# EAGLE design MCB-Laird-BL652-v2.0.0 (EAGLE 7.7.0)

## Sheet 1 of 2
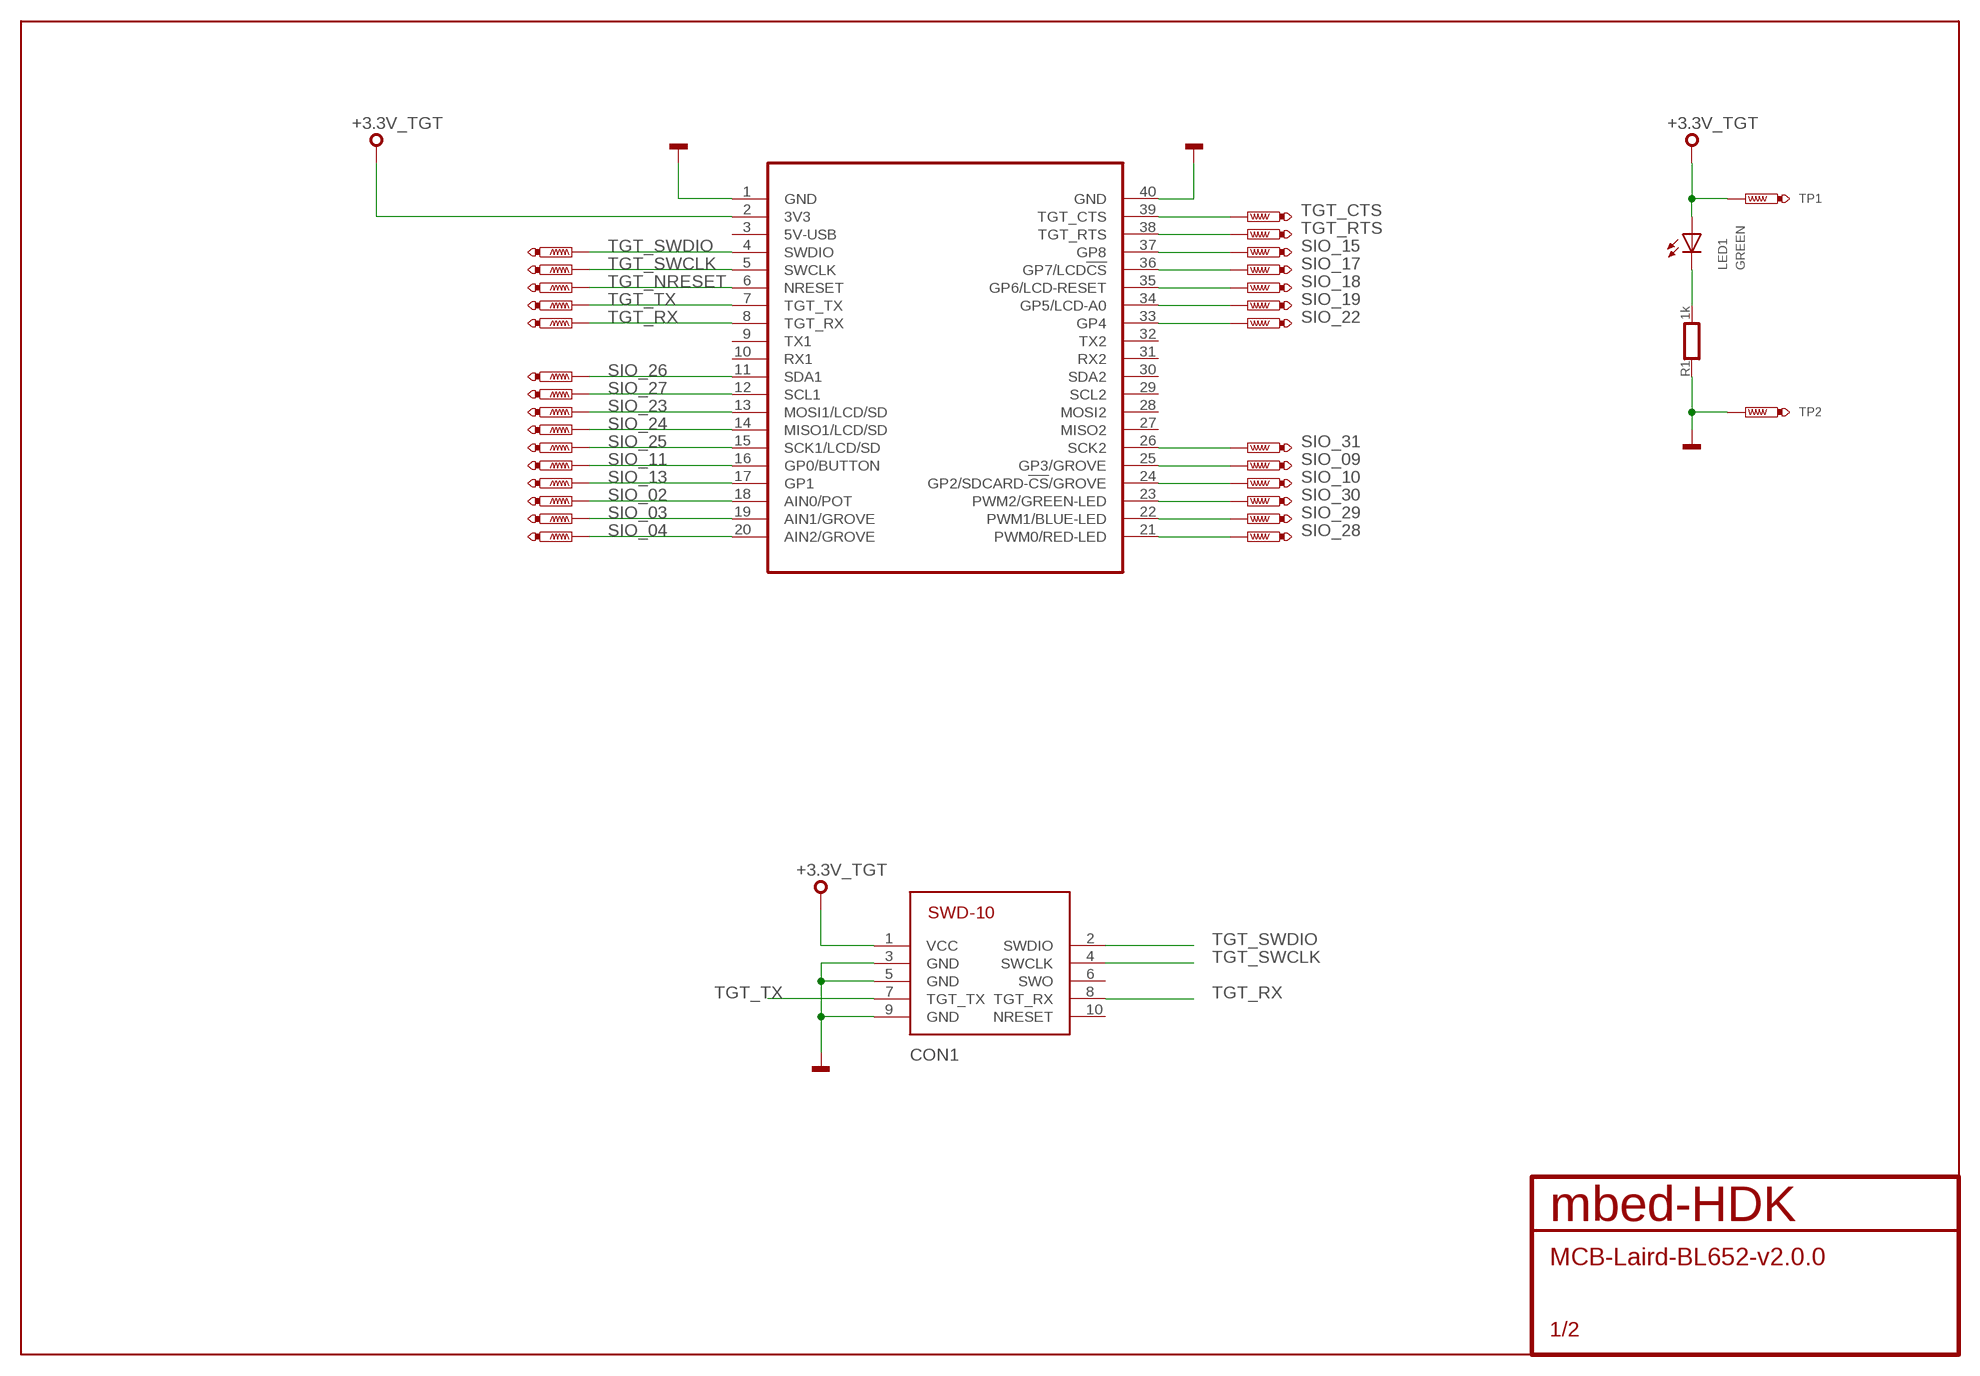
[diagram p0: schematic, sheet 1]

### Parts
CON1  SWD-10/TC2050_SMD  [FTSH-105-02]
LED1  GREEN  SMD_LED0603  [CHIPLED_0603]
MOD1  MODULE_DAUGHTER  [MODULE_DAUGHTER]
R1  1k  RESISTOR0603  [0603]
TP1  TEST-POINT-50R-PTH  [TP50-PTH]
TP2  TEST-POINT-50R-PTH  [TP50-PTH]
TP3  PTR1TP07R  [TP07R]
TP4  PTR1TP07R  [TP07R]
TP5  PTR1TP07R  [TP07R]
TP6  PTR1TP07R  [TP07R]
TP7  PTR1TP07R  [TP07R]
TP8  PTR1TP07R  [TP07R]
TP9  PTR1TP07R  [TP07R]
TP10  PTR1TP07R  [TP07R]
TP11  PTR1TP07R  [TP07R]
TP12  PTR1TP07R  [TP07R]
TP13  PTR1TP07R  [TP07R]
TP14  PTR1TP07R  [TP07R]
TP15  PTR1TP07R  [TP07R]
TP16  PTR1TP07R  [TP07R]
TP17  PTR1TP07R  [TP07R]
TP18  PTR1TP07R  [TP07R]
TP19  PTR1TP07R  [TP07R]
TP20  PTR1TP07R  [TP07R]
TP21  PTR1TP07R  [TP07R]
TP22  PTR1TP07R  [TP07R]
TP23  PTR1TP07R  [TP07R]
TP24  PTR1TP07R  [TP07R]
TP25  PTR1TP07R  [TP07R]
TP26  PTR1TP07R  [TP07R]
TP27  PTR1TP07R  [TP07R]
TP28  PTR1TP07R  [TP07R]
TP29  PTR1TP07R  [TP07R]
TP30  PTR1TP07R  [TP07R]

### Nets
+3.3V_TGT: CON1.1(VCC) LED1.A MOD1.2(3V3) TP1.TP ; also sheet 2
GND: CON1.3(GND) CON1.5(GND) CON1.9(GND) MOD1.1(GND) MOD1.40(GND) R1.1 TP2.TP ; also sheet 2
PA_1: LED1.C R1.2
SIO_02: MOD1.18(AIN0/POT) TP10.TP ; also sheet 2
SIO_03: MOD1.19(AIN1/GROVE) TP11.TP ; also sheet 2
SIO_04: MOD1.20(AIN2/GROVE) TP12.TP ; also sheet 2
SIO_09: MOD1.25(GP3/GROVE) TP17.TP ; also sheet 2
SIO_10: MOD1.24(GP2/SDCARD-!CS!/GROVE) TP16.TP ; also sheet 2
SIO_11: MOD1.16(GP0/BUTTON) TP8.TP ; also sheet 2
SIO_13: MOD1.17(GP1) TP9.TP ; also sheet 2
SIO_15: MOD1.37(GP8) TP22.TP ; also sheet 2
SIO_17: MOD1.36(GP7/LCD!CS) TP21.TP ; also sheet 2
SIO_18: MOD1.35(GP6/LCD-RESET) TP20.TP ; also sheet 2
SIO_19: MOD1.34(GP5/LCD-A0) TP19.TP ; also sheet 2
SIO_22: MOD1.33(GP4) TP18.TP ; also sheet 2
SIO_23: MOD1.13(MOSI1/LCD/SD) TP5.TP ; also sheet 2
SIO_24: MOD1.14(MISO1/LCD/SD) TP6.TP ; also sheet 2
SIO_25: MOD1.15(SCK1/LCD/SD) TP7.TP ; also sheet 2
SIO_26: MOD1.11(SDA1) TP3.TP ; also sheet 2
SIO_27: MOD1.12(SCL1) TP4.TP ; also sheet 2
SIO_28: MOD1.21(PWM0/RED-LED) TP13.TP ; also sheet 2
SIO_29: MOD1.22(PWM1/BLUE-LED) TP14.TP ; also sheet 2
SIO_30: MOD1.23(PWM2/GREEN-LED) TP15.TP ; also sheet 2
SIO_31: MOD1.26(SCK2) TP25.TP ; also sheet 2
TGT_CTS: MOD1.39(TGT_CTS) TP24.TP ; also sheet 2
TGT_NRESET: MOD1.6(NRESET) TP28.TP ; also sheet 2
TGT_RTS: MOD1.38(TGT_RTS) TP23.TP ; also sheet 2
TGT_RX: CON1.8(TGT_RX) MOD1.8(TGT_RX) TP30.TP ; also sheet 2
TGT_SWCLK: CON1.4(SWCLK) MOD1.5(SWCLK) TP27.TP ; also sheet 2
TGT_SWDIO: CON1.2(SWDIO) MOD1.4(SWDIO) TP26.TP ; also sheet 2
TGT_TX: CON1.7(TGT_TX) MOD1.7(TGT_TX) TP29.TP ; also sheet 2
Unconnected: CON1.6(SWO) CON1.10(NRESET) MOD1.3(5V-USB) MOD1.9(TX1) MOD1.10(RX1) MOD1.27(MISO2) MOD1.28(MOSI2) MOD1.29(SCL2) MOD1.30(SDA2) MOD1.31(RX2) MOD1.32(TX2)

## Sheet 2 of 2
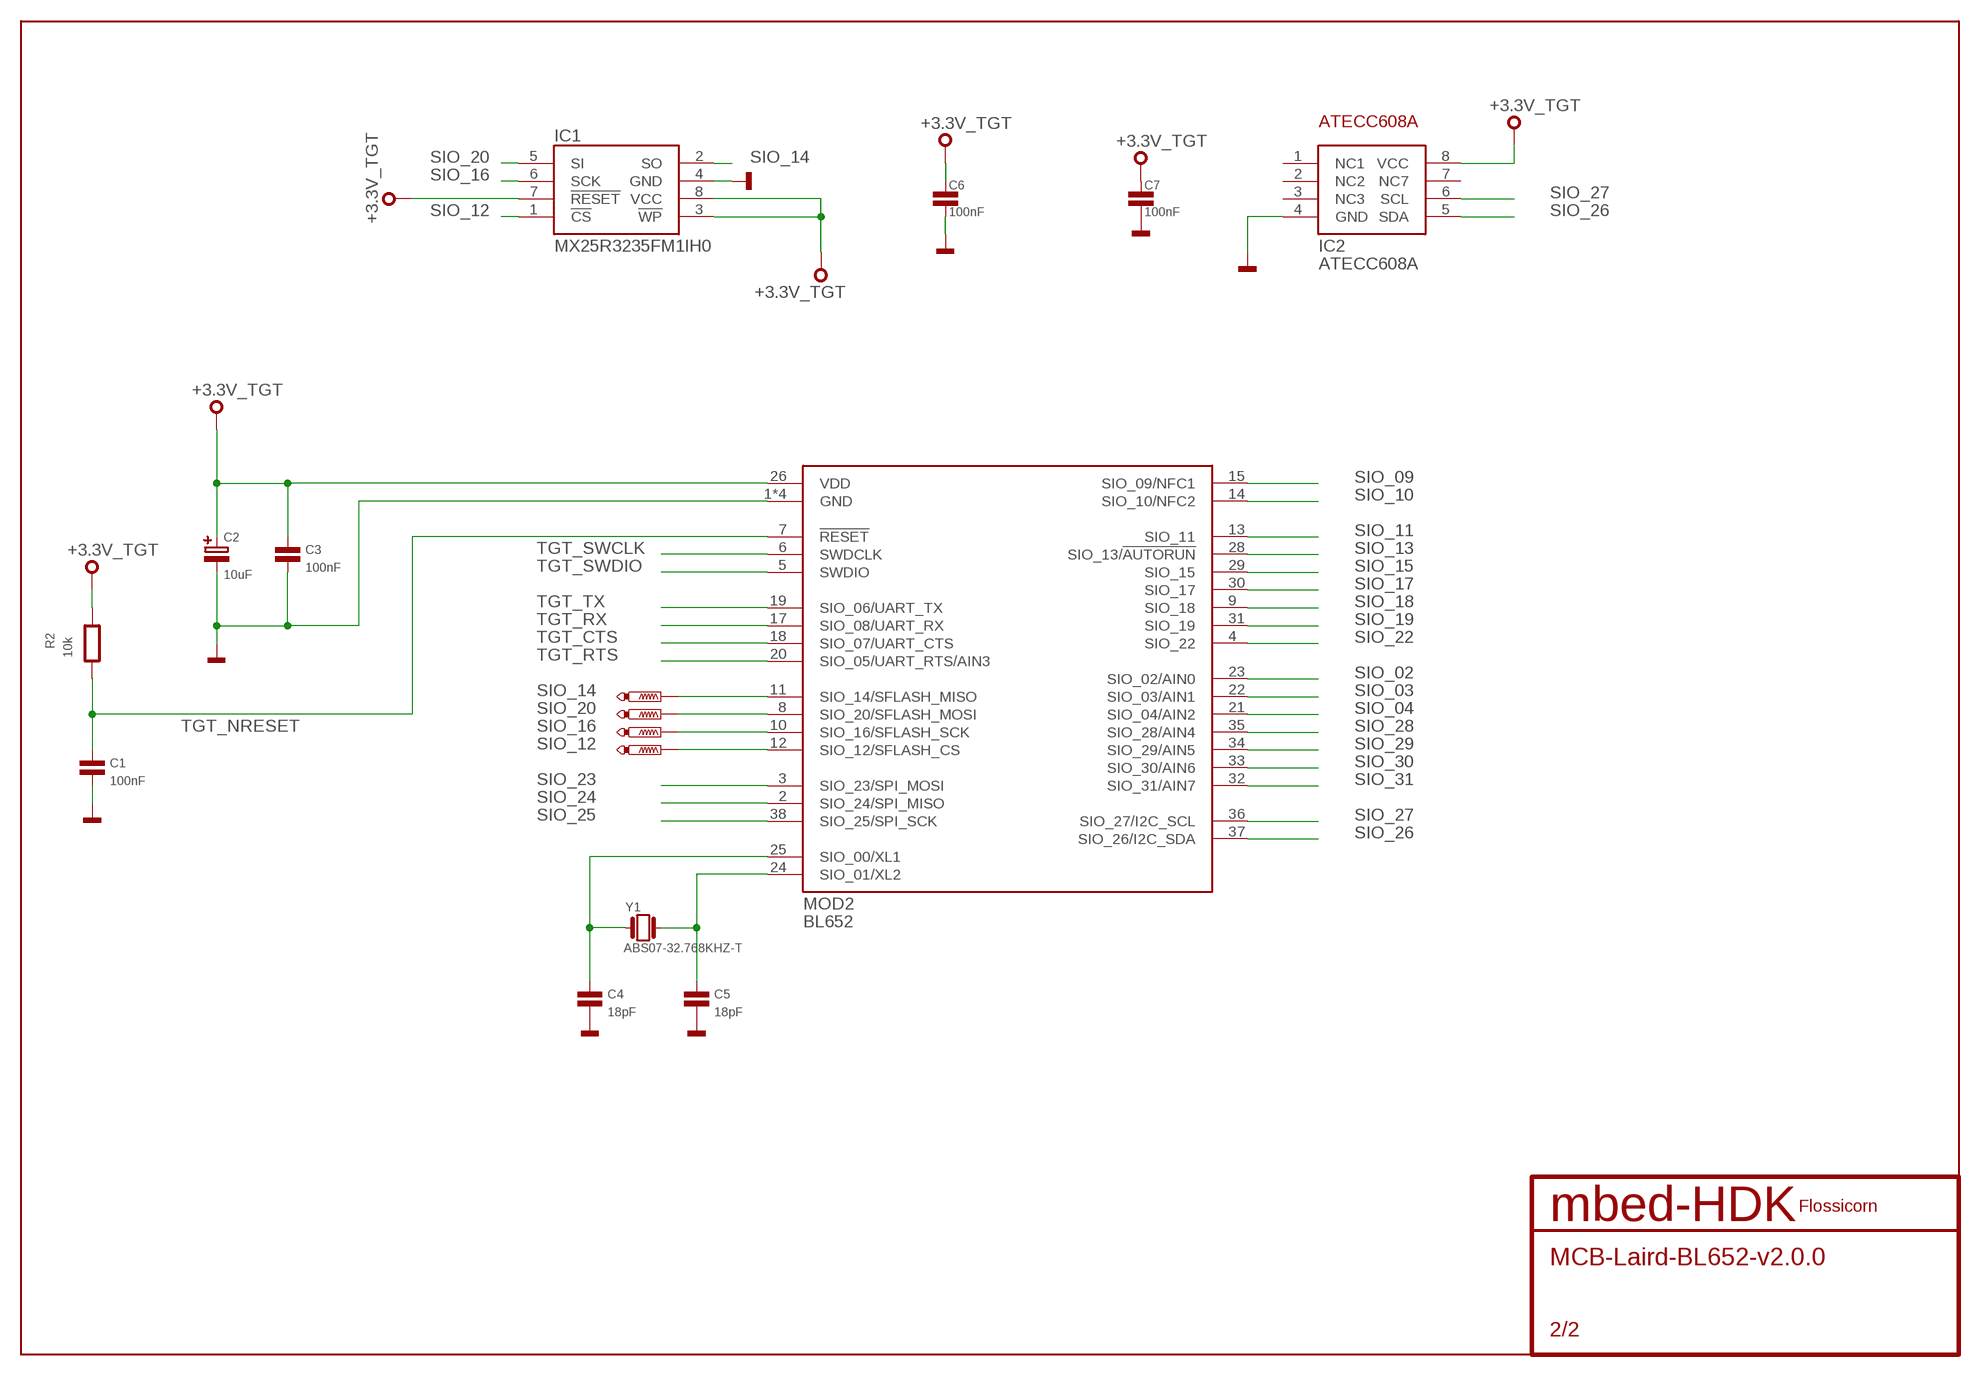
[diagram p1: schematic, sheet 2]

### Parts
C1  100nF  C0603  [0603]
C2  10uF  CAPACITOR-POLARISEDB  [SMC_B]
C3  100nF  C0603  [0603]
C4  18pF  C0603  [0603]
C5  18pF  C0603  [0603]
C6  100nF  CAPACITOR0603  [0603]
C7  100nF  CAPACITOR0603  [0603]
IC1  MX25R3235FM1IH0  [SO8]
IC2  ATECC608A  [SO8]
MOD2  BL652  [BL652]
R2  10k  RESISTOR0603  [0603]
SS1  FLOSSICORN0.25  [FLOSSICORN-0.25]
TP31  PTR1TP07R  [TP07R]
TP32  PTR1TP07R  [TP07R]
TP33  PTR1TP07R  [TP07R]
TP34  PTR1TP07R  [TP07R]
Y1  ABS07-32.768KHZ-T  [FC135]

### Nets
+3.3V_TGT: C2.+ C3.1 C6.1 C7.1 IC1.3(!WP) IC1.7(!RESET) IC1.8(VCC) IC2.8(VCC) MOD2.26(VDD) R2.2 ; also sheet 1
GND: C1.2 C2.- C3.2 C4.2 C5.2 C6.2 C7.2 IC1.4(GND) IC2.4(GND) MOD2.1(GND) MOD2.16(GND) MOD2.27(GND) MOD2.39(GND) ; also sheet 1
N$2: C5.1 MOD2.24(SIO_01/XL2) Y1.X2
N$3: C4.1 MOD2.25(SIO_00/XL1) Y1.X1
SIO_02: MOD2.23(SIO_02/AIN0) ; also sheet 1
SIO_03: MOD2.22(SIO_03/AIN1) ; also sheet 1
SIO_04: MOD2.21(SIO_04/AIN2) ; also sheet 1
SIO_09: MOD2.15(SIO_09/NFC1) ; also sheet 1
SIO_10: MOD2.14(SIO_10/NFC2) ; also sheet 1
SIO_11: MOD2.13(SIO_11) ; also sheet 1
SIO_12: IC1.1(!CS) MOD2.12(SIO_12/SFLASH_CS) TP34.TP
SIO_13: MOD2.28(SIO_13/!AUTORUN) ; also sheet 1
SIO_14: IC1.2(SO) MOD2.11(SIO_14/SFLASH_MISO) TP31.TP
SIO_15: MOD2.29(SIO_15) ; also sheet 1
SIO_16: IC1.6(SCK) MOD2.10(SIO_16/SFLASH_SCK) TP33.TP
SIO_17: MOD2.30(SIO_17) ; also sheet 1
SIO_18: MOD2.9(SIO_18) ; also sheet 1
SIO_19: MOD2.31(SIO_19) ; also sheet 1
SIO_20: IC1.5(SI) MOD2.8(SIO_20/SFLASH_MOSI) TP32.TP
SIO_22: MOD2.4(SIO_22) ; also sheet 1
SIO_23: MOD2.3(SIO_23/SPI_MOSI) ; also sheet 1
SIO_24: MOD2.2(SIO_24/SPI_MISO) ; also sheet 1
SIO_25: MOD2.38(SIO_25/SPI_SCK) ; also sheet 1
SIO_26: IC2.5(SDA) MOD2.37(SIO_26/I2C_SDA) ; also sheet 1
SIO_27: IC2.6(SCL) MOD2.36(SIO_27/I2C_SCL) ; also sheet 1
SIO_28: MOD2.35(SIO_28/AIN4) ; also sheet 1
SIO_29: MOD2.34(SIO_29/AIN5) ; also sheet 1
SIO_30: MOD2.33(SIO_30/AIN6) ; also sheet 1
SIO_31: MOD2.32(SIO_31/AIN7) ; also sheet 1
TGT_CTS: MOD2.18(SIO_07/UART_CTS) ; also sheet 1
TGT_NRESET: C1.1 MOD2.7(!RESET) R2.1 ; also sheet 1
TGT_RTS: MOD2.20(SIO_05/UART_RTS/AIN3) ; also sheet 1
TGT_RX: MOD2.17(SIO_08/UART_RX) ; also sheet 1
TGT_SWCLK: MOD2.6(SWDCLK) ; also sheet 1
TGT_SWDIO: MOD2.5(SWDIO) ; also sheet 1
TGT_TX: MOD2.19(SIO_06/UART_TX) ; also sheet 1
Unconnected: IC2.1(NC1) IC2.2(NC2) IC2.3(NC3) IC2.7(NC7)

## Library data of the parts
C1 C3-C5 = mbed-HDK-RLC:C: Capacitor
C2 = mbed-HDK-RLC:CAPACITOR-POLARISED: Polarised capacitor; MF: Kemet; MFN: T491B106K020AT; OC-DIGIKEY: 399-8298-1-ND; OC-MOUSER: 80-T491B106K020; OC-NEWARK: 57K1740
C6 C7 = mbed-HDK-RLC:CAPACITOR: Capacitor
CON1 = mbed-HDK-Connector:SWD-10/TC2050: 1mm pitch 10-Pin Cortex Programming Header with optional TC2050 footprint solderless interchangeable
IC1 = mbed-HDK-IC:MX25R3235FM1IH0: Serial Flash 32 Mb 80 Mhz; MF: Macronix; MFN: MX25R3235FM1IH0; OC-DIGIKEY: 1092-1175-ND
IC2 = mbed-HDK-MF-ATMEL:ATECC608A: I2C Secure element and crytpo accelerator; MF: Atmel; MFN: ATECC608A; OC-DIGIKEY: ATECC608A-SSHCZ-TCT-ND; OC-MOUSER: 556-ATECC608ASSHDAB
LED1 = mbed-HDK-Optical:SMD_LED: LED SMD, Colour Red; MF: Wurth Electronics Inc; MFN: 150060RS75000; OC-DIGIKEY: 732-4978-1-ND; OC-MOUSER: 710-150060RS75000; OC-NEWARK: 2322071
MOD1 = mbed-HDK-misc-Board:MODULE_DAUGHTER
MOD2 = mbed-HDK-MF-LAIRD:BL652: nRF52 Based BLE module; MF: Laird; MFN: BL652; OC-MOUSER: 239-BL652-SA-01; OC-NEWARK: 2664536
R1 R2 = mbed-HDK-RLC:RESISTOR: Resistor
SS1 = blackbriar:FLOSSICORN
TP1 TP2 = mbed-HDK:TEST-POINT
TP3-TP34 = blackbriar:PTR1: TEST PIN
Y1 = mbed-HDK-Oscillator:ABS07-32.768KHZ-T: Crystal, Abracon 32.768kHz ±20ppm 12.5pF; MF: Abracon; MFN: ABS07-32.768KHZ-T; OC-DIGIKEY: 535-9542-1-ND; OC-MOUSER: 535-9542-1-ND; OC-NEWARK: 2101347

## Board
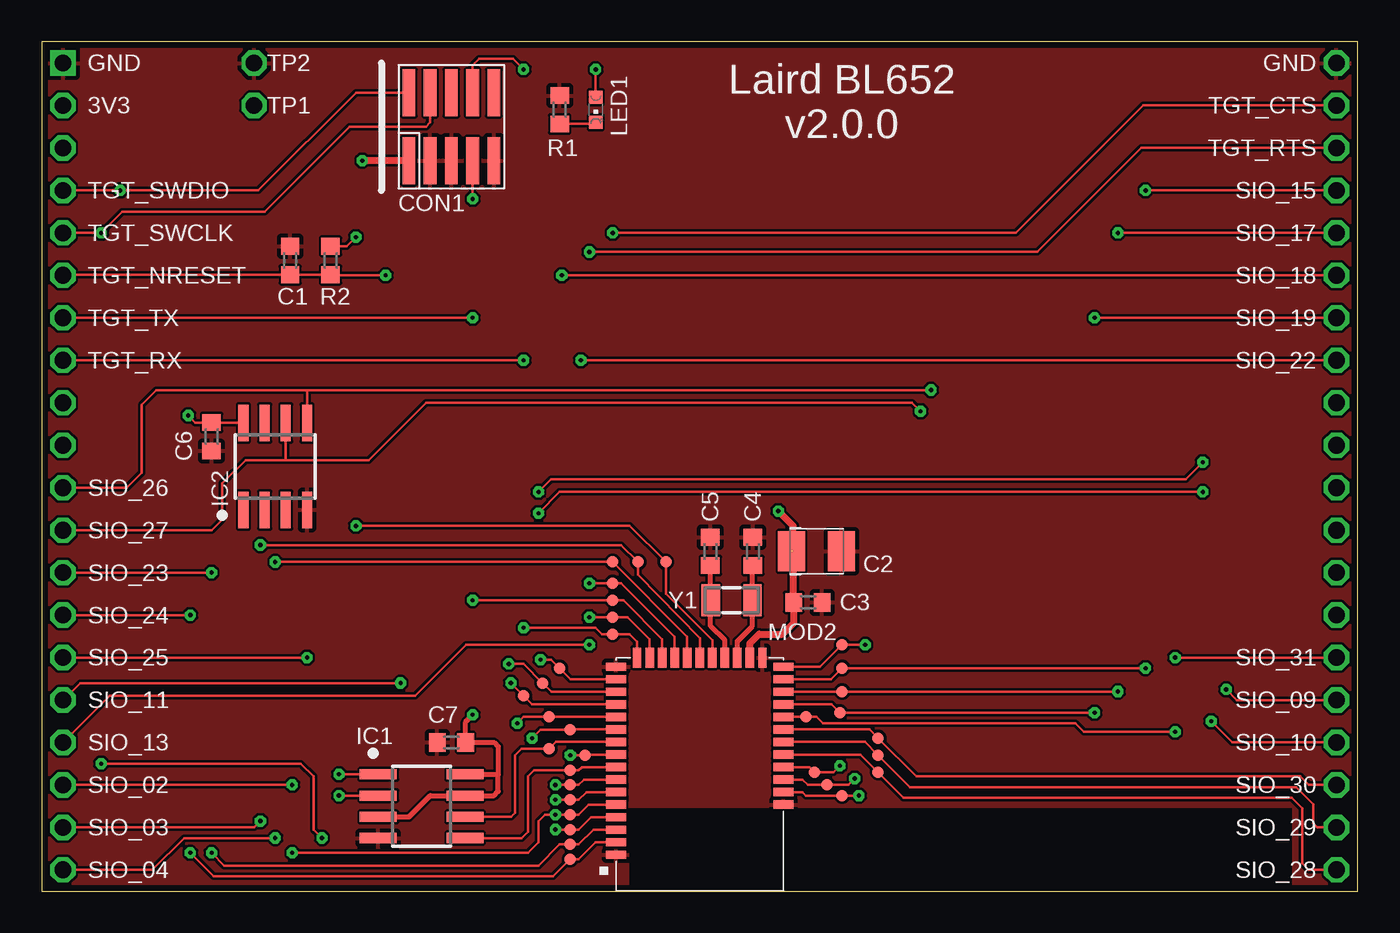
[diagram p2: board, top side]
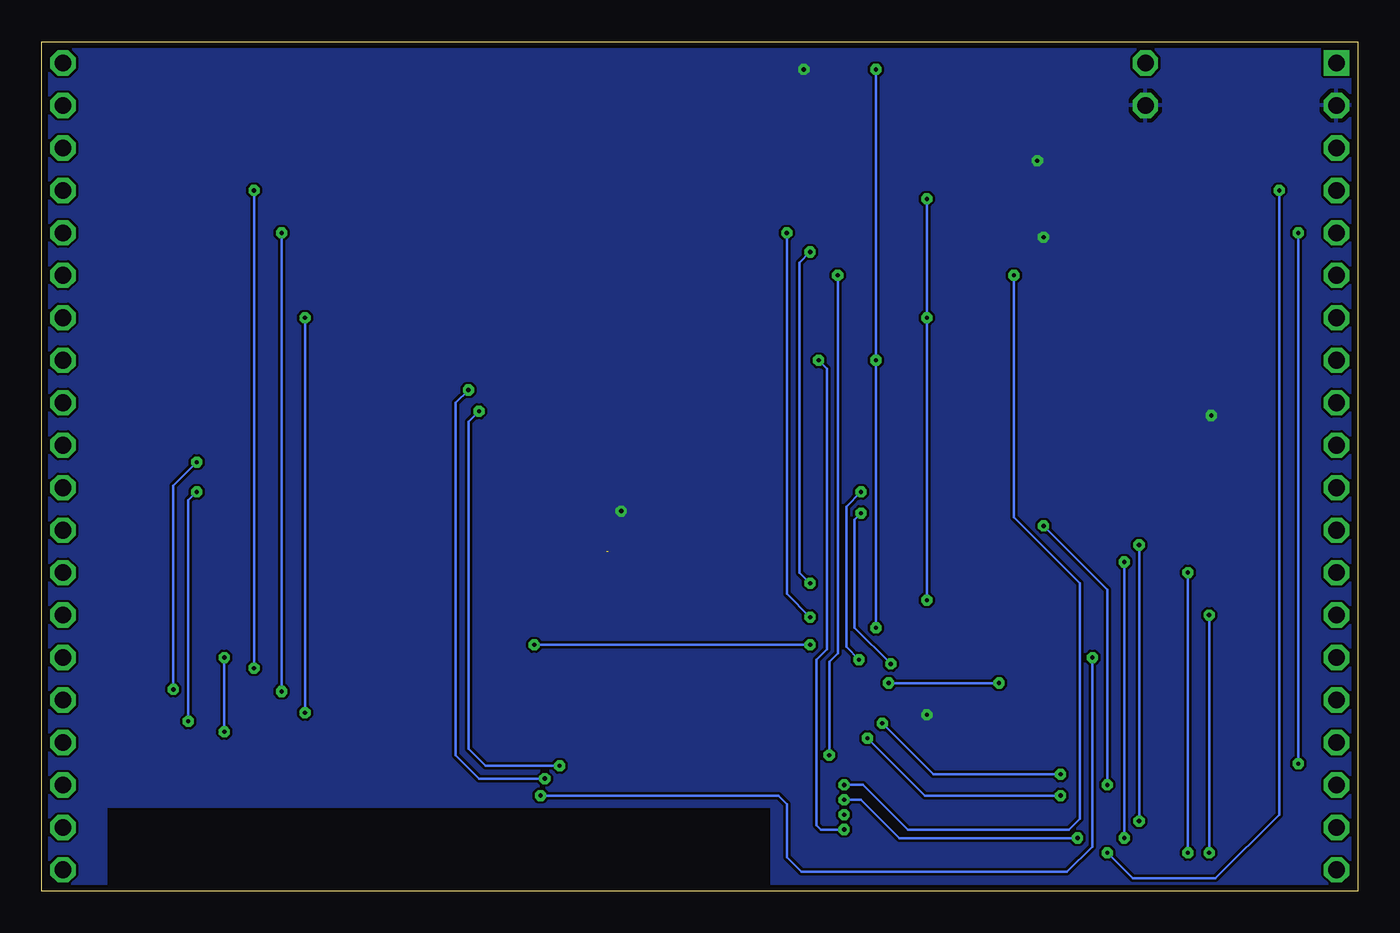
[diagram p3: board, bottom side, seen from below]

Size 78.74 x 50.8 mm. Coordinates in mm from the lower left corner, seen from the top.
Copper layers ((1*16)): Top 0.035mm / dielectric 0.8mm / Bottom 0.035mm
Design rules "mbed-HDK-6-6-2-layer *": minimum track width 6mil, minimum drill 9mil, track to track 6mil, track to pad 6mil, pad to pad 6mil, via to via 6mil, smd to smd 6mil, copper to edge 15mil, drill to drill 8mil, minimum pad ring 10mil, minimum via ring 8mil, stop-mask expansion 4mil, vias tented up to drill 0mil, thermal gap 10mil
tRestrict: area 35.2,0 to 74.8,5
bRestrict: area 35.2,0 to 74.8,5

### Footprints (pad centres in the part's own frame; a part is rotated, then mirrored left to right if it is on the bottom)
0603 = smd 1 x 1.1: 1 -0.85,0; 2 0.85,0
SMC_B = smd 1.6 x 2.4: + -1.5,0; - 1.5,0
FTSH-105-02 = smd 0.762 x 2.794: 1 0.381,-2.032; 2 0.381,2.032; 3 1.651,-2.032; 4 1.651,2.032; 5 2.921,-2.032; 6 2.921,2.032; 7 4.191,-2.032; 8 4.191,2.032; 9 5.461,-2.032; 10 5.461,2.032
SO8 = smd 0.6 x 2.2: 1 -1.905,-2.6; 2 -0.635,-2.6; 3 0.635,-2.6; 4 1.905,-2.6; 5 1.905,2.6; 6 0.635,2.6; 7 -0.635,2.6; 8 -1.905,2.6
CHIPLED_0603 = smd 0.8 x 0.8: A 0,-0.75; C 0,0.75
MODULE_DAUGHTER = drill 1 square: 1 0,0 | drill 1 octagon: 2 0,-2.54; 3 0,-5.08; 4 0,-7.62; 5 0,-10.16; 6 0,-12.7; 7 0,-15.24; 8 0,-17.78; 9 0,-20.32; 10 0,-22.86; 11 0,-25.4; 12 0,-27.94; 13 0,-30.48; 14 0,-33.02; 15 0,-35.56; 16 0,-38.1; 17 0,-40.64; 18 0,-43.18; 19 0,-45.72; 20 0,-48.26; 21 76.2,-48.26; 22 76.2,-45.72; 23 76.2,-43.18; 24 76.2,-40.64; 25 76.2,-38.1; 26 76.2,-35.56; 27 76.2,-33.02; 28 76.2,-30.48; 29 76.2,-27.94; 30 76.2,-25.4; 31 76.2,-22.86; 32 76.2,-20.32; 33 76.2,-17.78; 34 76.2,-15.24; 35 76.2,-12.7; 36 76.2,-10.16; 37 76.2,-7.62; 38 76.2,-5.08; 39 76.2,-2.54; 40 76.2,0
BL652 = smd 1.2 x 0.5: 1 5,11.8; 2 5,11.05; 3 5,10.3; 4 5,9.55; 5 5,8.8; 6 5,8.05; 7 5,7.3; 8 5,6.55; 9 5,5.8; 10 5,5.05; 11 5,4.3; 12 5,3.55; 13 5,2.8; 14 5,2.05; 15 5,1.3; 16 5,0.55; 28 -5,0.55; 29 -5,1.3; 30 -5,2.05; 31 -5,2.8; 32 -5,3.55; 33 -5,4.3; 34 -5,5.05; 35 -5,5.8; 36 -5,6.55; 37 -5,7.3; 38 -5,8.05; 39 -5,8.8 | smd 0.5 x 1.2: 17 3.75,0; 18 3,0; 19 2.25,0; 20 1.5,0; 21 0.75,0; 22 0,0; 23 -0.75,0; 24 -1.5,0; 25 -2.25,0; 26 -3,0; 27 -3.75,0
TP50-PTH = drill 1 octagon: TP 0,0
TP07R = smd 0.7 x 0.7: TP 0,0
FC135 = smd 1.1 x 1.9: X1 -1.25,0; X2 1.25,0

### Placement (x,y rotation side)
C1  14.86,37.72 90 top
C2  46.36,20.32 0 top
C3  45.85,17.27 0 top
C4  42.55,20.32 90 top
C5  40.01,20.32 90 top
C6  10.16,27.18 270 top
C7  24.51,8.89 180 top
CON1  21.59,45.72 0 top
IC1  22.73,5.08 270 top
IC2  13.97,25.4 0 top
LED1  33.15,46.74 180 top
MOD1  1.27,49.53 0 top
MOD2  39.37,13.97 180 top
R1  30.99,46.74 270 top
R2  17.27,37.72 90 top
SS1  21.59,35.94 0 top
TP1  12.7,46.99 0 top
TP2  12.7,49.53 0 top
TP3  46.99,6.35 0 top
TP4  46.23,7.11 0 top
TP5  31.62,2.79 0 top
TP6  31.62,1.91 0 top
TP7  47.88,5.72 90 top
TP8  28.83,11.68 90 top
TP9  47.88,14.73 90 top
TP10  37.34,19.69 180 top
TP11  35.69,19.69 180 top
TP12  34.16,19.69 90 top
TP13  50.04,7.11 270 top
TP14  50.04,8.13 270 top
TP15  50.04,9.14 270 top
TP16  29.97,12.45 0 top
TP17  30.99,13.34 270 top
TP18  31.62,3.68 180 top
TP19  47.75,10.67 270 top
TP20  32.51,8.13 270 top
TP21  47.88,11.94 270 top
TP22  47.88,13.34 270 top
TP23  34.16,18.42 270 top
TP24  34.16,16.38 270 top
TP25  45.72,10.41 0 top
TP26  31.62,4.57 0 top
TP27  31.62,5.46 0 top
TP28  31.62,6.35 0 top
TP29  34.16,17.4 0 top
TP30  34.16,15.37 0 top
TP31  31.62,9.65 0 top
TP32  31.62,7.24 0 top
TP33  30.35,8.51 0 top
TP34  30.35,10.41 0 top
Y1  41.28,17.4 180 top

### Tracks (layer width: path | path; a pad name or v marks a point on that pad's centre or on a via)
+3.3V_TGT  (via drill 0.25)  (1 unrouted)
  Top 0.152: LED1.A v33.15,49.15 | R2.2 18.25,38.57 v18.8,39.12 | v8.76,28.45 9.18,28.03 C6.1 12.04,28.03 IC2.8
  Top 0.305: 27.3,6.98 27.3,5.97 27.05,5.72 IC1.7 23.24,5.72 21.97,4.45 IC1.3 | IC1.8 27.3,6.98 | v25.78,10.54 25.36,10.12 C7.1 27.05,8.89 27.3,8.64 27.3,6.98
  Top 0.406: MOD2.26 42.37,14.81 42.93,15.37 44.32,15.37 45,16.04 C3.1 44.96,17.31 44.96,20.32 44.96,21.85 v44.07,22.73 | CON1.1 v19.18,43.69
  pour Bottom: 0,0 78.74,0 78.74,50.8 0,50.8
GND
  pour Top: 0,0 78.74,0 78.74,50.8 0,50.8
N$2
  Top 0.305: MOD2.24 40.87,15.01 40.03,15.86 Y1.X2 40.03,19.45 C5.1
N$3
  Top 0.305: MOD2.25 41.62,14.95 42.53,15.86 Y1.X1 42.53,19.45 C4.1
PA_1
  Top 0.152: R1.2 33.05,45.89 LED1.C
SIO_02  (via drill 0.25)
  Top 0.152: MOD2.23 40.12,15 37.34,17.78 TP10.TP 35.18,21.84 v18.8,21.84 | MOD1.18 v14.99,6.35
  Bottom 0.152: v14.99,6.35 14.99,18.03 v18.8,21.84
SIO_03  (via drill 0.25)
  Top 0.152: MOD2.22 39.37,15.11 35.69,18.92 TP11.TP 34.67,20.7 v13.08,20.7 | MOD1.19 12.7,3.81 v13.08,4.19
  Bottom 0.152: v13.08,4.19 v13.08,20.7
SIO_04  (via drill 0.25)
  Top 0.152: MOD2.21 38.62,15.23 TP12.TP v13.97,19.69 | MOD1.20 6.6,1.27 8.51,3.18 v13.97,3.18
  Bottom 0.152: v13.97,3.18 v13.97,19.69
SIO_09  (via drill 0.25)
  Top 0.152: MOD2.15 31.65,12.67 TP17.TP 30.48,13.84 v29.84,13.84 | MOD1.25 71.5,11.43 v70.87,12.06 | v69.47,25.65 68.45,24.64 30.48,24.64 v29.72,23.88
  Bottom 0.152: v29.84,13.84 30.61,14.61 30.61,22.99 v29.72,23.88 | v70.87,12.06 70.87,24.26 v69.47,25.65
SIO_10  (via drill 0.25)
  Top 0.152: MOD2.14 30.5,11.92 TP16.TP 28.83,13.59 v27.94,13.59 | MOD1.24 71.25,8.89 v69.98,10.16 | v69.47,23.88 30.99,23.88 v29.72,22.61
  Bottom 0.152: v27.94,13.59 30.1,15.75 30.1,22.23 v29.72,22.61 | v69.98,10.16 69.98,23.37 v69.47,23.88
SIO_11  (via drill 0.25)
  Top 0.152: MOD2.13 29.34,11.17 TP8.TP v28.07,12.45 | MOD1.16 2.29,12.45 v21.46,12.45
  Bottom 0.152: v21.46,12.45 v28.07,12.45
SIO_12  (via drill 0.25)
  Top 0.152: MOD2.12 TP34.TP 28.83,10.41 v28.45,10.03 | v17.78,6.98 IC1.1
  Bottom 0.152: v28.45,10.03 25.4,6.98 v17.78,6.98
SIO_13  (via drill 0.25)
  Top 0.152: MOD2.28 46.57,13.42 TP9.TP v49.28,14.73 | MOD1.17 4.06,11.68 22.35,11.68 25.4,14.73 v32.77,14.73
  Bottom 0.152: v32.77,14.73 v49.28,14.73
SIO_14  (via drill 0.25)
  Top 0.152: MOD2.11 31.64,9.67 TP31.TP 29.84,9.65 v29.34,9.14 | v17.78,5.72 IC1.2
  Bottom 0.152: v29.34,9.14 25.91,5.72 v17.78,5.72
SIO_15  (via drill 0.25)
  Top 0.152: MOD2.29 47.21,12.67 TP22.TP v66.04,13.34 | v66.04,41.91 MOD1.37
  Bottom 0.152: v66.04,13.34 v66.04,41.91
SIO_16
  Top 0.152: IC1.6 28.07,4.45 28.32,4.7 28.32,8.13 28.7,8.51 TP33.TP 30.76,8.92 MOD2.10
SIO_17  (via drill 0.25)
  Top 0.152: MOD2.30 47.86,11.92 TP21.TP v64.39,11.94 | v64.39,39.37 MOD1.36
  Bottom 0.152: v64.39,11.94 v64.39,39.37
SIO_18  (via drill 0.25)
  Top 0.152: v31.62,8.13 TP20.TP 32.55,8.17 MOD2.9 | v31.11,36.83 MOD1.35
  Bottom 0.152: v31.62,8.13 31.62,13.72 31.11,14.22 v31.11,36.83
SIO_19  (via drill 0.25)
  Top 0.152: MOD2.31 47.25,11.17 TP19.TP v62.99,10.67 | v62.99,34.29 MOD1.34
  Bottom 0.152: v62.99,10.67 v62.99,34.29
SIO_20
  Top 0.152: IC1.5 28.7,3.18 29.08,3.56 29.08,6.86 29.46,7.24 TP32.TP 32.13,7.24 32.31,7.42 MOD2.8
SIO_22  (via drill 0.25)
  Top 0.152: v30.73,3.68 TP18.TP 32.13,3.68 32.87,4.42 MOD2.4 | v32.26,31.75 MOD1.33
  Bottom 0.152: v30.73,3.68 32.13,3.68 32.38,3.94 32.38,13.84 31.75,14.48 31.75,31.24 v32.26,31.75
SIO_23  (via drill 0.25)
  Top 0.152: MOD2.3 33.01,3.67 32.13,2.79 TP5.TP 30.99,2.79 29.72,1.52 10.92,1.52 v10.16,2.29 | v10.16,19.05 MOD1.13
  Bottom 0.152: v10.16,2.29 v10.16,19.05
SIO_24  (via drill 0.25)
  Top 0.152: MOD2.2 33.15,2.92 32.13,1.91 TP6.TP 30.61,0.89 10.29,0.89 v8.89,2.29 | v8.89,16.51 MOD1.14
  Bottom 0.152: v8.89,2.29 v8.89,16.51
SIO_25  (via drill 0.25)
  Top 0.152: MOD2.38 45.52,5.92 45.72,5.72 TP7.TP v48.9,5.72 | MOD1.15 v15.88,13.97
  Bottom 0.152: v15.88,13.97 15.88,2.67 17.4,1.14 33.27,1.14 34.16,2.03 34.16,5.21 34.67,5.72 v48.9,5.72
SIO_26  (via drill 0.25)
  Top 0.152: MOD2.37 45.53,6.67 45.85,6.35 TP3.TP 48.26,6.35 v48.64,6.73 | MOD1.11 5.08,24.13 5.97,25.02 5.97,29.08 6.86,29.97 15.88,29.97 | IC2.5 15.88,29.97 | 15.88,29.97 v53.21,29.97
  Bottom 0.152: v48.64,6.73 52.58,6.73 53.98,8.13 53.98,29.21 v53.21,29.97
SIO_27  (via drill 0.25)
  Top 0.152: MOD2.36 45.92,7.42 TP4.TP 47.37,7.11 v47.75,7.49 | MOD1.12 10.16,21.59 10.79,22.23 10.79,24.38 12.19,25.78 14.61,25.78 | 14.61,25.78 19.56,25.78 22.99,29.21 52.07,29.21 v52.58,28.7 | IC2.6 14.61,25.78
  Bottom 0.152: v52.58,28.7 53.21,28.07 53.21,8.51 52.2,7.49 v47.75,7.49
SIO_28
  Top 0.152: MOD1.21 75.82,1.27 75.44,1.65 75.44,4.95 74.8,5.59 51.56,5.59 TP13.TP 48.98,8.17 MOD2.35
SIO_29
  Top 0.152: MOD1.22 76.33,3.81 76.07,4.06 76.07,5.21 75.06,6.22 51.94,6.22 TP14.TP 49.25,8.92 MOD2.34
SIO_30
  Top 0.152: MOD1.23 75.82,6.35 75.31,6.86 52.32,6.86 TP15.TP 49.51,9.67 MOD2.33
SIO_31  (via drill 0.25)
  Top 0.152: MOD2.32 TP25.TP 46.36,10.41 46.74,10.03 61.85,10.03 62.36,9.52 v67.82,9.52 | v67.82,13.97 MOD1.26
  Bottom 0.152: v67.82,9.52 v67.82,13.97
TGT_CTS  (via drill 0.25)
  Top 0.152: MOD2.18 36.37,15.06 35.05,16.38 TP24.TP v32.77,16.38 | MOD1.39 65.91,46.99 58.29,39.37 v34.16,39.37
  Bottom 0.152: v34.16,39.37 34.16,17.78 v32.77,16.38
TGT_NRESET  (via drill 0.25)
  Top 0.152: v30.73,6.35 TP28.TP 32.13,6.35 32.45,6.67 MOD2.7 | v20.57,36.83 17.31,36.83 R2.1 C1.1 1.31,36.87 MOD1.6
  Bottom 0.152: v30.73,6.35 29.59,6.35 26.92,3.68 17.27,3.68 16.64,4.32 16.64,18.42 20.57,22.35 v20.57,36.83
TGT_RTS  (via drill 0.25)
  Top 0.152: MOD2.20 37.87,15.22 34.67,18.42 TP23.TP v32.77,18.42 | MOD1.38 65.79,44.45 59.56,38.23 v32.77,38.23
  Bottom 0.152: v32.77,38.23 33.4,37.59 33.4,19.05 v32.77,18.42
TGT_RX  (via drill 0.25)
  Top 0.152: MOD2.17 35.62,14.93 35.18,15.37 TP30.TP 33.53,15.37 33.15,15.75 v28.83,15.75 | v28.83,49.15 28.19,49.78 26.16,49.78 25.78,49.4 CON1.8 | MOD1.8 v28.83,31.75
  Bottom 0.152: v28.83,15.75 v28.83,31.75 v28.83,49.15
TGT_SWCLK  (via drill 0.25)
  Top 0.152: v30.73,5.46 TP27.TP 32.13,5.46 32.59,5.92 MOD2.6 | MOD1.5 v3.56,39.37 4.83,40.64 13.33,40.64 18.41,45.72 22.99,45.72 23.24,45.97 CON1.4 | v3.56,7.62 15.49,7.62 16.26,6.86 16.26,3.68 v16.76,3.18
  Bottom 0.152: v3.56,39.37 v3.56,7.62 | v16.76,3.18 27.43,3.18 29.72,5.46 v30.73,5.46
TGT_SWDIO  (via drill 0.25)
  Top 0.152: MOD2.5 32.73,5.17 32.13,4.57 TP26.TP v30.73,4.57 30.1,4.57 29.72,4.19 29.72,2.92 29.08,2.29 v14.99,2.29 | MOD1.4 v4.7,41.91 12.95,41.91 18.8,47.75 CON1.2
  Bottom 0.152: v4.7,41.91 4.7,4.57 8.51,0.76 13.46,0.76 v14.99,2.29
TGT_TX  (via drill 0.25)
  Top 0.152: MOD2.19 37.12,15.08 34.8,17.4 TP29.TP v25.78,17.4 | CON1.7 v25.78,41.4 | MOD1.7 v25.78,34.29
  Bottom 0.152: v25.78,41.4 v25.78,34.29 v25.78,17.4

### Text on the board
tPlace: GND / 3V3 / / TGT_SWDIO / TGT_SWCLK / TGT_NRESET / TGT_TX / TGT_RX / / / SIO_26 / SIO_27 / SIO_23 / SIO_24 / SIO_25 / SIO_11 / SIO_13 / SIO_02 / SIO_03 / SIO_04 | GND / TGT_CTS / TGT_RTS / SIO_15 / SIO_17 / SIO_18 / SIO_19 / SIO_22 / / / / / / / SIO_31 / SIO_09 / SIO_10 / SIO_30 / SIO_29 / SIO_28 | Laird BL652 / v2.0.0